# Altium schematic sheet 07_Bluetooth.SchDoc
size OrCAD B
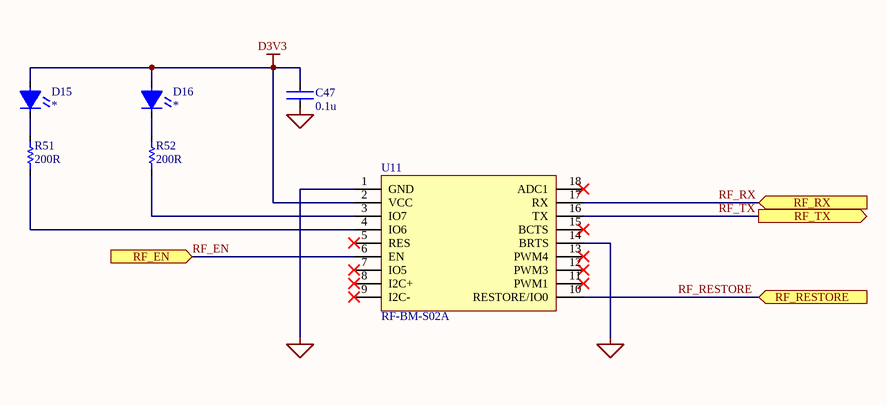
[diagram p0: 07_Bluetooth.SchDoc]

## Parts
C47  0.1u  [C0402]
D15  *  [LED0603]
D16  *  [LED0603]
R51  200R  [R0402]
R52  200R  [R0402]
U11  RF-BM-S02A  [RF-BM-S02A]

## Ports
RF_EN (in), RF_RESTORE (in), RF_RX (in), RF_TX (out)

## Nets
D3V3: C47.1 D15.1(L20) D16.1(L20) U11.2(VCC)
GND: C47.2 U11.1(GND) U11.14(BRTS)
RF_EN: U11.6(EN) ; port RF_EN
RF_RESTORE: U11.10(RESTORE/IO0) ; port RF_RESTORE
RF_RX: U11.17(RX) ; port RF_RX
RF_TX: U11.16(TX) ; port RF_TX
NetD15_2: D15.2(L21) R51.2
NetD16_2: D16.2(L21) R52.2
NetR51_1: R51.1 U11.4(IO6)
NetR52_1: R52.1 U11.3(IO7)

Not connected (* = marked no-connect by the designer): U11 5(RES)* 7(IO5)* 8(I2C+)* 9(I2C-)* 11(PWM1)* 12(PWM3)* 13(PWM4)* 15(BCTS)* 18(ADC1)*

## Library data of the parts
C47 = CAP011: CAP,Ceramic,X7R,10%,16V,0.1uF,0402; Manufacturer1: *; Manufacturer2: *; PartNumberManufacturer1: *; UnitPrice: *; Value: 0.1u
D15 D16 = LED YellowGreen0603: LED,Yellow Green,2V,20mA,0603; Manufacturer1: *; PartNumberManufacturer2: *; Manufacturer2: *; PartNumberManufacturer1: *; UnitPrice: *
R51 R52 = RES0110: RES,200R,1%,1/16W,0402; Manufacturer1: *; PartNumberManufacturer2: *; Manufacturer2: *; PartNumberManufacturer1: *; Value: 200R; UnitPrice: *
U11 = RF-BM-S02A: Bluetooth module, UART, 18PIN, SMD; Manufacturer1: RF STAR; Manufacturer2: *; PartNumberManufacturer1: RF-BM-S02A; PartNumberManufacturer2: *